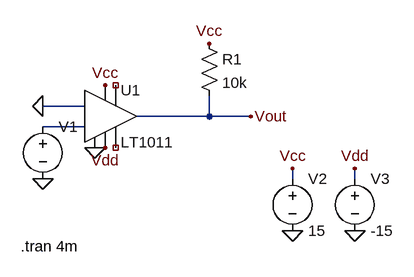
[diagram p0: schematic Comparateur_LT1011.asc]
Comparateur_LT1011.asc, the LTspice schematic file:
Version 4
SHEET 1 880 680
WIRE 144 144 80 144
WIRE 336 160 336 128
WIRE 336 160 224 160
WIRE 400 160 336 160
WIRE 144 176 80 176
WIRE 464 256 464 240
WIRE 560 256 560 240
FLAG 160 208 0
FLAG 80 144 0
FLAG 464 336 0
FLAG 560 336 0
FLAG 464 240 Vcc
FLAG 176 112 Vcc
FLAG 560 240 Vdd
FLAG 176 208 Vdd
FLAG 80 256 0
FLAG 400 160 Vout
FLAG 336 48 Vcc
SYMBOL Comparators\\LT1011 176 160 R0
SYMATTR InstName U1
SYMBOL res 320 32 R0
SYMATTR InstName R1
SYMATTR Value 10k
SYMBOL voltage 80 160 R0
WINDOW 3 24 96 Invisible 2
WINDOW 123 0 0 Left 0
WINDOW 39 0 0 Left 0
SYMATTR InstName V1
SYMATTR Value PULSE(-5 5 0 1n 1n 0.5m 1m)
SYMBOL voltage 464 240 R0
WINDOW 123 0 0 Left 0
WINDOW 39 0 0 Left 0
SYMATTR InstName V2
SYMATTR Value 15
SYMBOL voltage 560 240 R0
WINDOW 123 0 0 Left 0
WINDOW 39 0 0 Left 0
SYMATTR InstName V3
SYMATTR Value -15
TEXT 46 360 Left 2 !.tran 4m

The netlist it stands for:
* Comparateur_LT1011.asc
XU1 0 N001 0 Vdd NC_01 NC_02 Vout Vcc LT1011
R1 Vcc Vout 10k
V1 N001 0 PULSE(-5 5 0 1n 1n 0.5m 1m)
V2 Vcc 0 15
V3 Vdd 0 -15
.tran 4m
.lib LTC1.lib
.backanno
.end